# Altium schematic sheet Buzzer-Schematic.SchDoc
size A; SheetNumber: 1
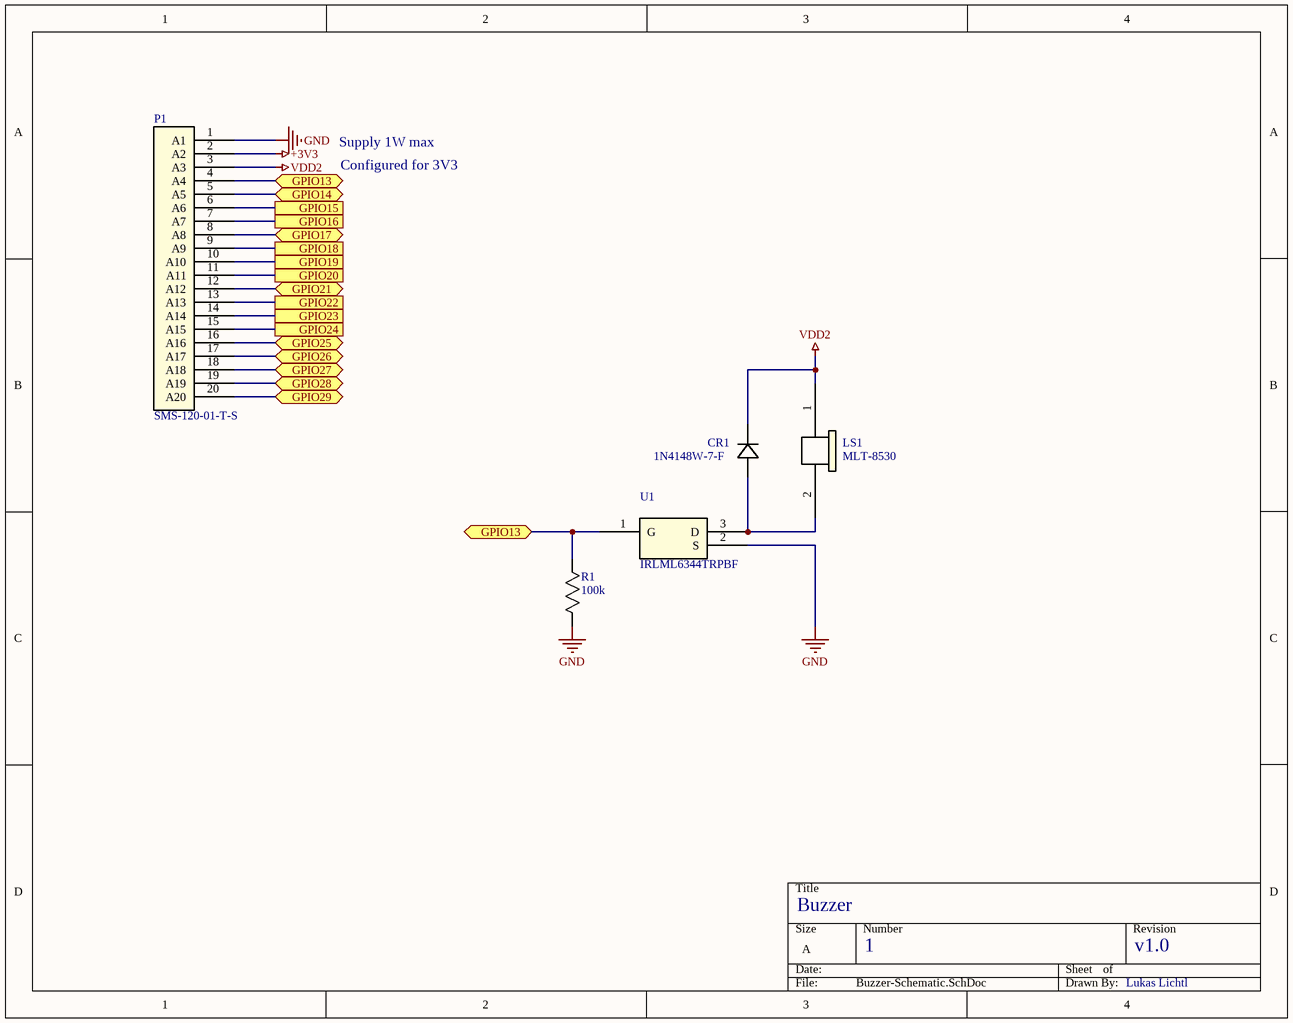
[diagram p0: Buzzer-Schematic.SchDoc]

## Parts
CR1  1N4148W-7-F  [SOD123_DIO]
LS1  MLT-8530  [MLT-8530_JHE]
P1  SMS-120-01-T-S  [SMS-S-120]
R1  100k  [RC0603N_YAG]
U1  IRLML6344TRPBF  [IRLML6344TRPBF_INF]

## Ports
GPIO13 (bidir), GPIO14 (bidir), GPIO15, GPIO16, GPIO17 (bidir), GPIO18, GPIO19, GPIO20, GPIO21 (bidir), GPIO22, GPIO23, GPIO24, GPIO25 (bidir), GPIO26 (bidir), GPIO27 (bidir), GPIO28 (bidir), GPIO29 (bidir)

## Nets
+3V3: P1.2(A2)
GND: P1.1(A1) R1.1 U1.2(S)
VDD2: CR1.1 LS1.1 P1.3(A3)
GPIO13: P1.4(A4) R1.2 U1.1(G) ; port GPIO13
GPIO14: P1.5(A5) ; port GPIO14
GPIO15: P1.6(A6) ; port GPIO15
GPIO16: P1.7(A7) ; port GPIO16
GPIO17: P1.8(A8) ; port GPIO17
GPIO18: P1.9(A9) ; port GPIO18
GPIO19: P1.10(A10) ; port GPIO19
GPIO20: P1.11(A11) ; port GPIO20
GPIO21: P1.12(A12) ; port GPIO21
GPIO22: P1.13(A13) ; port GPIO22
GPIO23: P1.14(A14) ; port GPIO23
GPIO24: P1.15(A15) ; port GPIO24
GPIO25: P1.16(A16) ; port GPIO25
GPIO26: P1.17(A17) ; port GPIO26
GPIO27: P1.18(A18) ; port GPIO27
GPIO28: P1.19(A19) ; port GPIO28
GPIO29: P1.20(A20) ; port GPIO29
NetCR1_2: CR1.2 LS1.2 U1.3(D)

## Notes on the sheet
- Supply 1W max
- Configured for 3V3
- Buzzer
- 1
- v1.0
- Lukas Lichtl

## Library data of the parts
CR1 = 1N4148W-7-F: No Description Available; Mfr_Name: Diodes Inc
LS1 = MLT-8530: No Description Available; Mfr_Name: Jiangsu Huaneng Elec; RefDes: RefDes; Type: Type
P1 = SMS-120-01-T-S: No Description Available; Mfr_Name: Samtec Inc; RefDes: RefDes; Type: Type
R1 = RC0603FR-07470RL: No Description Available; Mfr_Name: Yageo
U1 = IRLML6344TRPBF: No Description Available; Mfr_Name: Infineon; RefDes: RefDes; Type: Type